# EAGLE schematic Pocket_Bucket (EAGLE 9.6.2)
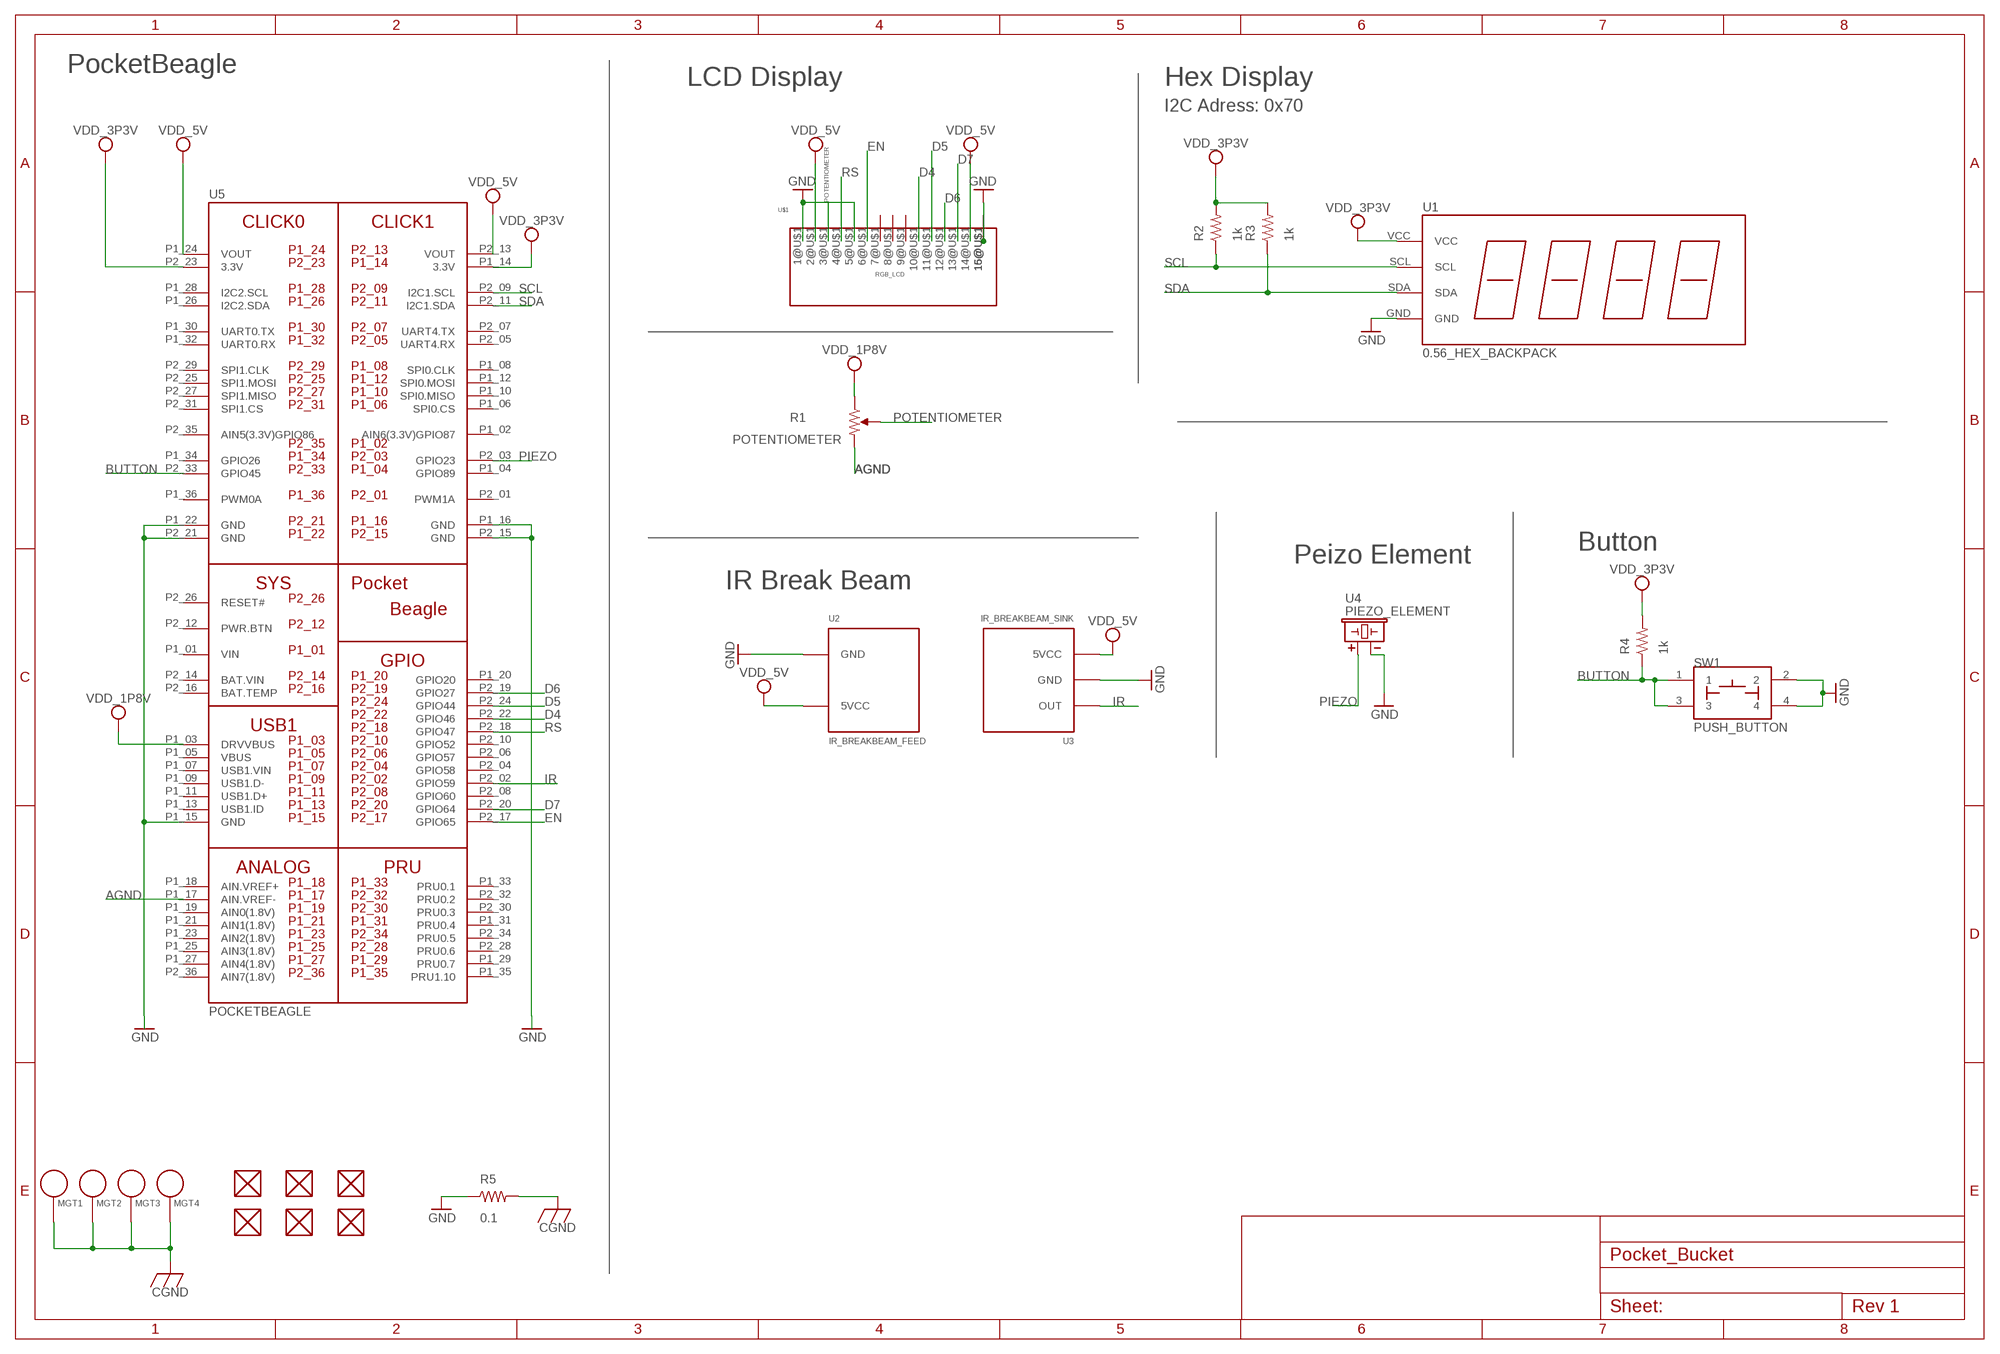
[diagram p0: schematic, sheet 1]

## Parts
FUD1  FIDUCIAL  [FIDUCIAL_40MIL]
FUD2  FIDUCIAL  [FIDUCIAL_40MIL]
FUD3  FIDUCIAL  [FIDUCIAL_40MIL]
FUD4  FIDUCIAL  [FIDUCIAL_40MIL]
FUD5  FIDUCIAL  [FIDUCIAL_40MIL]
FUD6  FIDUCIAL  [FIDUCIAL_40MIL]
MGT1  MOUNTING_HOLE  [MOUNTING_HOLE]
MGT2  MOUNTING_HOLE  [MOUNTING_HOLE]
MGT3  MOUNTING_HOLE  [MOUNTING_HOLE]
MGT4  MOUNTING_HOLE  [MOUNTING_HOLE]
R1  POTENTIOMETER  [POT-PO90S]
R2  1k  R_R0603  [R0603]
R3  1k  R_R0603  [R0603]
R4  1k  R_R0603  [R0603]
R5  0.1  R_R0805  [R0805]
SW1  PUSH_BUTTON  [BUTTON_12.5MM]
U1  0.56_HEX_BACKPACK  [0.56_HEX_BACKPACK]
U2  IR_BREAKBEAM_FEED  [IR_BREAKBEAM_FEED]
U3  IR_BREAKBEAM_SINK  [IR_BREAKBEAM_SINK]
U4  PIEZO_ELEMENT  [BUZZER_6.5MM]
U5  POCKETBEAGLE  [POCKETBEAGLE]
U$1  RGB_LCD  [ADAFRUIT_RGB_LCD]

## Nets
AGND: R1.CW U5.P1_15(GND) U5.P1_17(AIN.VREF-) U5.P1_22(GND) U5.P2_21(GND) ; supply symbol labelled GND
BUTTON: R4.1 SW1.1 SW1.3 U5.P2_33(GPIO45)
CGND: MGT1.P$1 MGT2.P$1 MGT3.P$1 MGT4.P$1 R5.2
D4: U5.P2_22(GPIO46) U$1.10@U$1(DB3)
D5: U5.P2_24(GPIO44) U$1.11@U$1(DB4)
D6: U5.P2_19(GPIO27) U$1.12@U$1(DB5)
D7: U5.P2_20(GPIO64) U$1.13@U$1(DB6)
EN: U5.P2_17(GPIO65) U$1.6@U$1(E)
GND: R5.1 SW1.2 SW1.4 U1.GND U2.GND U3.GND U4.- U5.P1_16(GND) U5.P2_15(GND) U$1.1@U$1(VSS) U$1.5@U$1(RW) U$1.15@U$1(A) U$1.16@U$1(K)
IR: U3.OUT U5.P2_02(GPIO59)
PIEZO: U4.+ U5.P2_03(GPIO23)
POTENTIOMETER: R1.S U$1.3@U$1(V0)
RS: U5.P2_18(GPIO47) U$1.4@U$1(RS)
SCL: R2.1 U1.SCL U5.P2_09(I2C1.SCL)
SDA: R3.1 U1.SDA U5.P2_11(I2C1.SDA)
VDD_1P8V: R1.CCW U5.P1_03(DRVVBUS)
VDD_3P3V: R2.2 R3.2 R4.2 U1.VCC U5.P1_14(3.3V) U5.P2_23(3.3V)
VDD_5V: U2.5VCC U3.5VCC U5.P1_24(VOUT) U5.P2_13(VOUT) U$1.2@U$1(VDD) U$1.14@U$1(DB7)
Unconnected: FUD1.P$1 FUD2.P$1 FUD3.P$1 FUD4.P$1 FUD5.P$1 FUD6.P$1 U5.P1_02(AIN6(3.3V)GPIO87) U5.P1_04(GPIO89) U5.P1_05(VBUS) U5.P1_06(SPI0.CS) U5.P1_07(USB1.VIN) U5.P1_08(SPI0.CLK) U5.P1_09(USB1.D-) U5.P1_10(SPI0.MISO) U5.P1_11(USB1.D+) U5.P1_12(SPI0.MOSI) U5.P1_13(USB1.ID) U5.P1_18(AIN.VREF+) U5.P1_19(AIN0(1.8V)) U5.P1_20(GPIO20) U5.P1_21(AIN1(1.8V)) U5.P1_23(AIN2(1.8V)) U5.P1_25(AIN3(1.8V)) U5.P1_26(I2C2.SDA) U5.P1_27(AIN4(1.8V)) U5.P1_28(I2C2.SCL) U5.P1_29(PRU0.7) U5.P1_30(UART0.TX) U5.P1_31(PRU0.4) U5.P1_32(UART0.RX) U5.P1_33(PRU0.1) U5.P1_34(GPIO26) U5.P1_35(PRU1.10) U5.P1_36(PWM0A) U5.P2_01(PWM1A) U5.P2_04(GPIO58) U5.P2_05(UART4.RX) U5.P2_06(GPIO57) U5.P2_07(UART4.TX) U5.P2_08(GPIO60) U5.P2_10(GPIO52) U5.P2_12(PWR.BTN) U5.P2_16(BAT.TEMP) U5.P2_25(SPI1.MOSI) U5.P2_26(RESET#) U5.P2_27(SPI1.MISO) U5.P2_28(PRU0.6) U5.P2_29(SPI1.CLK) U5.P2_30(PRU0.3) U5.P2_31(SPI1.CS) U5.P2_32(PRU0.2) U5.P2_34(PRU0.5) U5.P2_35(AIN5(3.3V)GPIO86) U5.P2_36(AIN7(1.8V)) U$1.7@U$1(DB0) U$1.8@U$1(DB1) U$1.9@U$1(DB2)

## Notes on the sheet
- PocketBeagle
- LCD Display | Hex Display
- I2C Adress: 0x70
- Button
- Peizo Element
- IR Break Beam

## Power pins joined to a net without a drawn wire
BAT.VIN: U5.P2_14(BAT.VIN)
VIN: U5.P1_01(VIN)

## Library data of the parts
FUD1-FUD6 = Pocket_Bucket:FIDUCIAL
MGT1-MGT4 = Pocket_Bucket:MOUNTING_HOLE: Chassis Mounting Hole w/GND connection ability
R1 = Pocket_Bucket:POTENTIOMETER: Potentiometer - Examples: P090S-14T20BR10K (987-1277-ND)
R2-R5 = Pocket_Bucket:R_: RESISTOR, American symbol
SW1 = Pocket_Bucket:PUSH_BUTTON
U1 = Pocket_Bucket:0.56_HEX_BACKPACK: 0.56" LED HEX Backback - Adafruit HT16K33 - https://www.adafruit.com/product/878 - https://www.adafruit.com/product/879 - https://www.adafruit.com/product/880 - https://www.adafruit.com/product/881 - https://www.adafruit.com/product/1002
U2 = Pocket_Bucket:IR_BREAKBEAM_FEED: IR Breakbeam feeder with two inputs
U3 = Pocket_Bucket:IR_BREAKBEAM_SINK
U4 = Pocket_Bucket:PIEZO_ELEMENT: 1739 Large Enclosed Piezo Element 2/ Wires
U5 = Pocket_Bucket:POCKETBEAGLE
U$1 = Pocket_Bucket:RGB_LCD: GWT-C1627A-RGB